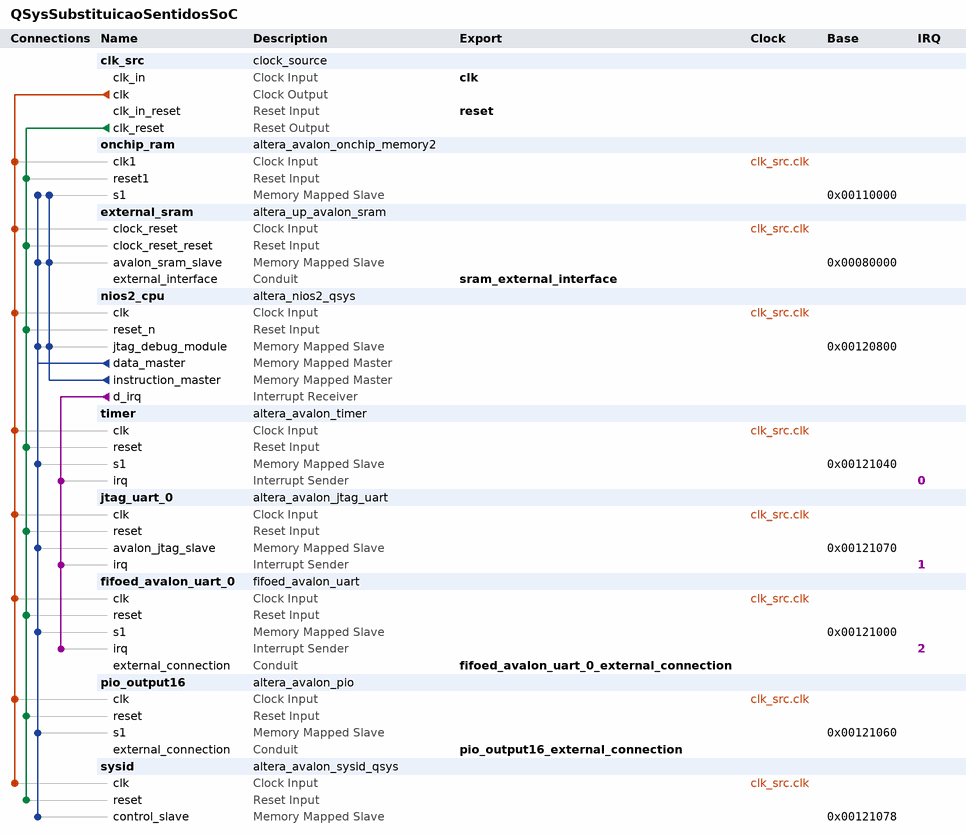
[diagram p0: system contents]
# Platform Designer (Qsys) system QSysSubstituicaoSentidosSoC, Cyclone II EP2C35F672C6
# Parameters at their usual value, and those the tool derives, are not listed.
package require -exact qsys 13.0
create_system QSysSubstituicaoSentidosSoC
set_project_property DEVICE_FAMILY {Cyclone II}
set_project_property DEVICE EP2C35F672C6

add_instance clk_src clock_source 13.0
set_instance_parameter_value clk_src clockFrequency 50000000

add_instance onchip_ram altera_avalon_onchip_memory2 13.0.1.99.2
set_instance_parameter_value onchip_ram dataWidth 32
set_instance_parameter_value onchip_ram dualPort false
set_instance_parameter_value onchip_ram initMemContent true
set_instance_parameter_value onchip_ram initializationFileName onchip_mem.hex
set_instance_parameter_value onchip_ram memorySize 56480

add_instance external_sram altera_up_avalon_sram 13.0
set_instance_parameter_value external_sram board DE2
set_instance_parameter_value external_sram pixel_buffer false

add_instance nios2_cpu altera_nios2_qsys 13.0
set_instance_parameter_value nios2_cpu resetSlave external_sram.avalon_sram_slave
set_instance_parameter_value nios2_cpu mmu_TLBMissExcSlave None
set_instance_parameter_value nios2_cpu exceptionSlave external_sram.avalon_sram_slave
set_instance_parameter_value nios2_cpu breakSlave nios2_cpu.jtag_debug_module
set_instance_parameter_value nios2_cpu impl Small
set_instance_parameter_value nios2_cpu icache_size 1024

add_instance timer altera_avalon_timer 13.0.1.99.2
set_instance_parameter_value timer period 1
set_instance_parameter_value timer periodUnits MSEC

add_instance jtag_uart_0 altera_avalon_jtag_uart 13.0.1.99.2
set_instance_parameter_value jtag_uart_0 simInteractiveOptions NO_INTERACTIVE_WINDOWS

add_instance fifoed_avalon_uart_0 fifoed_avalon_uart 13.2
set_instance_parameter_value fifoed_avalon_uart_0 baud 115200
set_instance_parameter_value fifoed_avalon_uart_0 dataBits 8
set_instance_parameter_value fifoed_avalon_uart_0 fixedBaud true
set_instance_parameter_value fifoed_avalon_uart_0 parity NONE
set_instance_parameter_value fifoed_avalon_uart_0 simInteractiveInputEnable false
set_instance_parameter_value fifoed_avalon_uart_0 simInteractiveOutputEnable false
set_instance_parameter_value fifoed_avalon_uart_0 simTrueBaud false
set_instance_parameter_value fifoed_avalon_uart_0 stopBits 1
set_instance_parameter_value fifoed_avalon_uart_0 syncRegDepth 2
set_instance_parameter_value fifoed_avalon_uart_0 useCtsRts false
set_instance_parameter_value fifoed_avalon_uart_0 useEopRegister false
set_instance_parameter_value fifoed_avalon_uart_0 useRelativePathForSimFile false
set_instance_parameter_value fifoed_avalon_uart_0 use_status_bit_clear false
set_instance_parameter_value fifoed_avalon_uart_0 use_tx_fifo true
set_instance_parameter_value fifoed_avalon_uart_0 fifo_size_tx 32
set_instance_parameter_value fifoed_avalon_uart_0 tx_fifo_LE false
set_instance_parameter_value fifoed_avalon_uart_0 tx_IRQ_Threshold 1
set_instance_parameter_value fifoed_avalon_uart_0 use_rx_fifo false
set_instance_parameter_value fifoed_avalon_uart_0 fifo_size_rx 8
set_instance_parameter_value fifoed_avalon_uart_0 rx_fifo_LE false
set_instance_parameter_value fifoed_avalon_uart_0 rx_IRQ_Threshold 1
set_instance_parameter_value fifoed_avalon_uart_0 fifo_export_used false
set_instance_parameter_value fifoed_avalon_uart_0 hw_cts false
set_instance_parameter_value fifoed_avalon_uart_0 trans_pin false
set_instance_parameter_value fifoed_avalon_uart_0 use_timout false
set_instance_parameter_value fifoed_avalon_uart_0 timeout_value 4
set_instance_parameter_value fifoed_avalon_uart_0 use_gap_detection false
set_instance_parameter_value fifoed_avalon_uart_0 gap_value 4
set_instance_parameter_value fifoed_avalon_uart_0 use_timestamp false
set_instance_parameter_value fifoed_avalon_uart_0 use_ext_timestamp false
set_instance_parameter_value fifoed_avalon_uart_0 timestamp_width 8
set_instance_parameter_value fifoed_avalon_uart_0 export_handshake false
set_instance_parameter_value fifoed_avalon_uart_0 add_error_bits false
set_instance_parameter_value fifoed_avalon_uart_0 driver_pass_error_bits false

add_instance pio_output16 altera_avalon_pio 13.0.1.99.2
set_instance_parameter_value pio_output16 direction Output
set_instance_parameter_value pio_output16 width 16

add_instance sysid altera_avalon_sysid_qsys 13.0
set_instance_parameter_value sysid id 305419896

# connections
add_connection clk_src.clk external_sram.clock_reset clock
add_connection clk_src.clk fifoed_avalon_uart_0.clk clock
add_connection clk_src.clk jtag_uart_0.clk clock
add_connection clk_src.clk nios2_cpu.clk clock
add_connection clk_src.clk onchip_ram.clk1 clock
add_connection clk_src.clk pio_output16.clk clock
add_connection clk_src.clk sysid.clk clock
add_connection clk_src.clk timer.clk clock
add_connection clk_src.clk_reset external_sram.clock_reset_reset reset
add_connection clk_src.clk_reset fifoed_avalon_uart_0.reset reset
add_connection clk_src.clk_reset jtag_uart_0.reset reset
add_connection clk_src.clk_reset nios2_cpu.reset_n reset
add_connection clk_src.clk_reset onchip_ram.reset1 reset
add_connection clk_src.clk_reset pio_output16.reset reset
add_connection clk_src.clk_reset sysid.reset reset
add_connection clk_src.clk_reset timer.reset reset
add_connection nios2_cpu.data_master external_sram.avalon_sram_slave avalon
set_connection_parameter_value nios2_cpu.data_master/external_sram.avalon_sram_slave baseAddress 0x00080000
add_connection nios2_cpu.data_master fifoed_avalon_uart_0.s1 avalon
set_connection_parameter_value nios2_cpu.data_master/fifoed_avalon_uart_0.s1 baseAddress 0x00121000
add_connection nios2_cpu.data_master jtag_uart_0.avalon_jtag_slave avalon
set_connection_parameter_value nios2_cpu.data_master/jtag_uart_0.avalon_jtag_slave baseAddress 0x00121070
add_connection nios2_cpu.data_master nios2_cpu.jtag_debug_module avalon
set_connection_parameter_value nios2_cpu.data_master/nios2_cpu.jtag_debug_module baseAddress 0x00120800
add_connection nios2_cpu.data_master onchip_ram.s1 avalon
set_connection_parameter_value nios2_cpu.data_master/onchip_ram.s1 baseAddress 0x00110000
add_connection nios2_cpu.data_master pio_output16.s1 avalon
set_connection_parameter_value nios2_cpu.data_master/pio_output16.s1 baseAddress 0x00121060
add_connection nios2_cpu.data_master sysid.control_slave avalon
set_connection_parameter_value nios2_cpu.data_master/sysid.control_slave baseAddress 0x00121078
add_connection nios2_cpu.data_master timer.s1 avalon
set_connection_parameter_value nios2_cpu.data_master/timer.s1 baseAddress 0x00121040
add_connection nios2_cpu.instruction_master external_sram.avalon_sram_slave avalon
set_connection_parameter_value nios2_cpu.instruction_master/external_sram.avalon_sram_slave baseAddress 0x00080000
add_connection nios2_cpu.instruction_master nios2_cpu.jtag_debug_module avalon
set_connection_parameter_value nios2_cpu.instruction_master/nios2_cpu.jtag_debug_module baseAddress 0x00120800
add_connection nios2_cpu.instruction_master onchip_ram.s1 avalon
set_connection_parameter_value nios2_cpu.instruction_master/onchip_ram.s1 baseAddress 0x00110000
add_connection nios2_cpu.d_irq fifoed_avalon_uart_0.irq interrupt
set_connection_parameter_value nios2_cpu.d_irq/fifoed_avalon_uart_0.irq irqNumber 2
add_connection nios2_cpu.d_irq jtag_uart_0.irq interrupt
set_connection_parameter_value nios2_cpu.d_irq/jtag_uart_0.irq irqNumber 1
add_connection nios2_cpu.d_irq timer.irq interrupt
set_connection_parameter_value nios2_cpu.d_irq/timer.irq irqNumber 0

# exported interfaces
add_interface clk clock sink
set_interface_property clk EXPORT_OF clk_src.clk_in
add_interface reset reset sink
set_interface_property reset EXPORT_OF clk_src.clk_in_reset
add_interface pio_output16_external_connection conduit end
set_interface_property pio_output16_external_connection EXPORT_OF pio_output16.external_connection
add_interface fifoed_avalon_uart_0_external_connection conduit end
set_interface_property fifoed_avalon_uart_0_external_connection EXPORT_OF fifoed_avalon_uart_0.external_connection
add_interface sram_external_interface conduit end
set_interface_property sram_external_interface EXPORT_OF external_sram.external_interface

set_interconnect_requirement {$system} qsys_mm.clockCrossingAdapter HANDSHAKE
set_interconnect_requirement {$system} qsys_mm.maxAdditionalLatency 1

save_system QSysSubstituicaoSentidosSoC.qsys
